# Altium schematic sheet [3]USB.SchDoc
size B
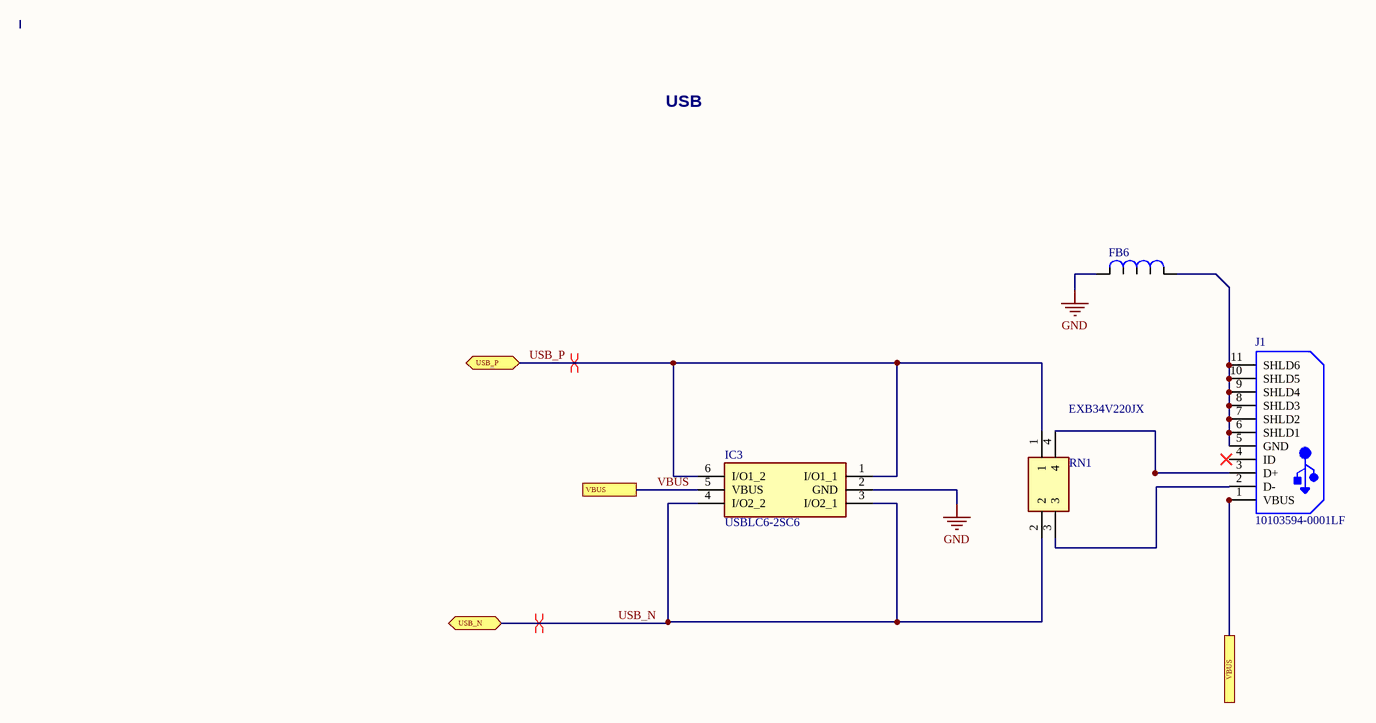
[diagram p0: [3]USB.SchDoc]

## Parts
FB6  BLM18AG102SN1D  [Ferrite Bead]  (value not drawn)
IC3  USBLC6-2SC6  [SOT95P280X145-6N]
J1  10103594-0001LF  [FCI-10103594-0001LF_V]
RN1  EXB34V220JX  [EXB34V103JV]

## Ports
USB_N (bidir), USB_P (bidir), VBUS

## Nets
GND: FB6.2 IC3.2(GND)
USB_N: IC3.3(I/O2_1) IC3.4(I/O2_2) RN1.2 ; port USB_N
USB_P: IC3.1(I/O1_1) IC3.6(I/O1_2) RN1.1 ; port USB_P
VBUS: IC3.5(VBUS) J1.1(VBUS) ; port VBUS
NetFB6_1: FB6.1 J1.5(GND) J1.6(SHLD1) J1.7(SHLD2) J1.8(SHLD3) J1.9(SHLD4) J1.10(SHLD5) J1.11(SHLD6)
NetJ1_2: J1.2(D-) RN1.3
NetJ1_3: J1.3(D+) RN1.4

Not connected (* = marked no-connect by the designer): J1 4(ID)

## Layout directives
differential pair; differential pair class USBDiffPair: USB_N, USB_P

## Notes on the sheet
- USB
- 8
- 7
- 6
- 5
- 4
- 3
- DWG. NO.
- REV.
- SHT.
- REVISION
- 2
- DESCRIPTION
- DATE
- 1
- APPROVED
- THIS DOCUMENT AND THE DATA DISCLOSED HEREIN OR HEREWITH IS THE PROPERTY OF ALTIUM LIMITED AND MAY BE FREELY DISTRIBUTED IN WHOLE. NO RIGHTS ARE RESERVED OR EXPRESS OR IMPLIED WARANTEE GIVEN.
- F
- E
- D
- C
- B
- A
- SCALE:
- A3
- SIZE
- CAGE CODE
- FILE NAME
- DWG NO.
- SHEET
- OF
- REV

## Library data of the parts
FB6 = Ferrite Bead: Ferrite Bead 1KOhm @100MHz; Datasheet: https://www.murata.com/en-us/products/productdata/8796738650142/ENFA0003.pdf?src-supplier=Digi-Key; Supplier 1: Mouser; Supplier Part Number 1: 81-BLM11A102S; PN: BLM18AG102SN1D
IC3 = USBLC6-2SC6: Integrated Circuit; Manufacturer_Name: STMicroelectronics; Datasheet Link: http://www.st.com/st-web-ui/static/active/en/resource/technical/document/datasheet/CD00050750.pdf; Height: 1.45mm; Manufacturer_Part_Number: USBLC6-2SC6; Mouser Part Number: 511-USBLC6-2SC6; Mouser Price/Stock: https://www.mouser.co.uk/ProductDetail/STMicroelectronics/USBLC6-2SC6/?qs=po45yt2pPpu%2FhNIlwQdTlg%3D%3D; Arrow Part Number: USBLC6-2SC6; Arrow Price/Stock: https://www.arrow.com/en/products/usblc6-2sc6/stmicroelectronics
J1 = CMP-002-00038-1: Micro USB 2.0 B Receptacle, 5 Position, Height 3.24 mm, -55 to 85 degC, RoHS, Tape and Reel; Manufacturer: FCI Electronics; Voltage Rating: 100V; Gender: Female; Current Rating: 1.8A; Min Operating Temperature: -55°C; Pins: 5; Contact Plating: Gold; Package Description: 5-Pin Surface Mount Device, Body 8.04 x 5.62 mm; RoHS Compliant: True; Lead Pitch: 0.65mm; Packaging: TapeandReel; Case/Package: FCI-10103594-0001LF; Manufacturer URL: http://portal.fciconnect.com/; Mounting Technology: SM; Datasheet Version: Rev. A, 06/2010; Connector Type: USB; Contact Material: Copper; Datasheet URL: http://portal.fciconnect.com/Comergent//fci/drawing/10103594.pdf; Max Operating Temperature: 85°C; Package Quantity: 1500; Package Reference: FCI-10103594-0001LF
RN1 = EXB34V330JV: Resistor Network; Manufacturer_Name: Panasonic; Datasheet Link: https://industrial.panasonic.com/cdbs/www-data/pdf/AOC0000/AOC0000C14.pdf; Height: 0.5mm; Manufacturer_Part_Number: EXB34V330JV; ComponentLink1Description: EXB24/34V; ComponentLink1URL: https://www.mouser.ca/datasheet/2/315/AOC0000C14-1108062.pdf